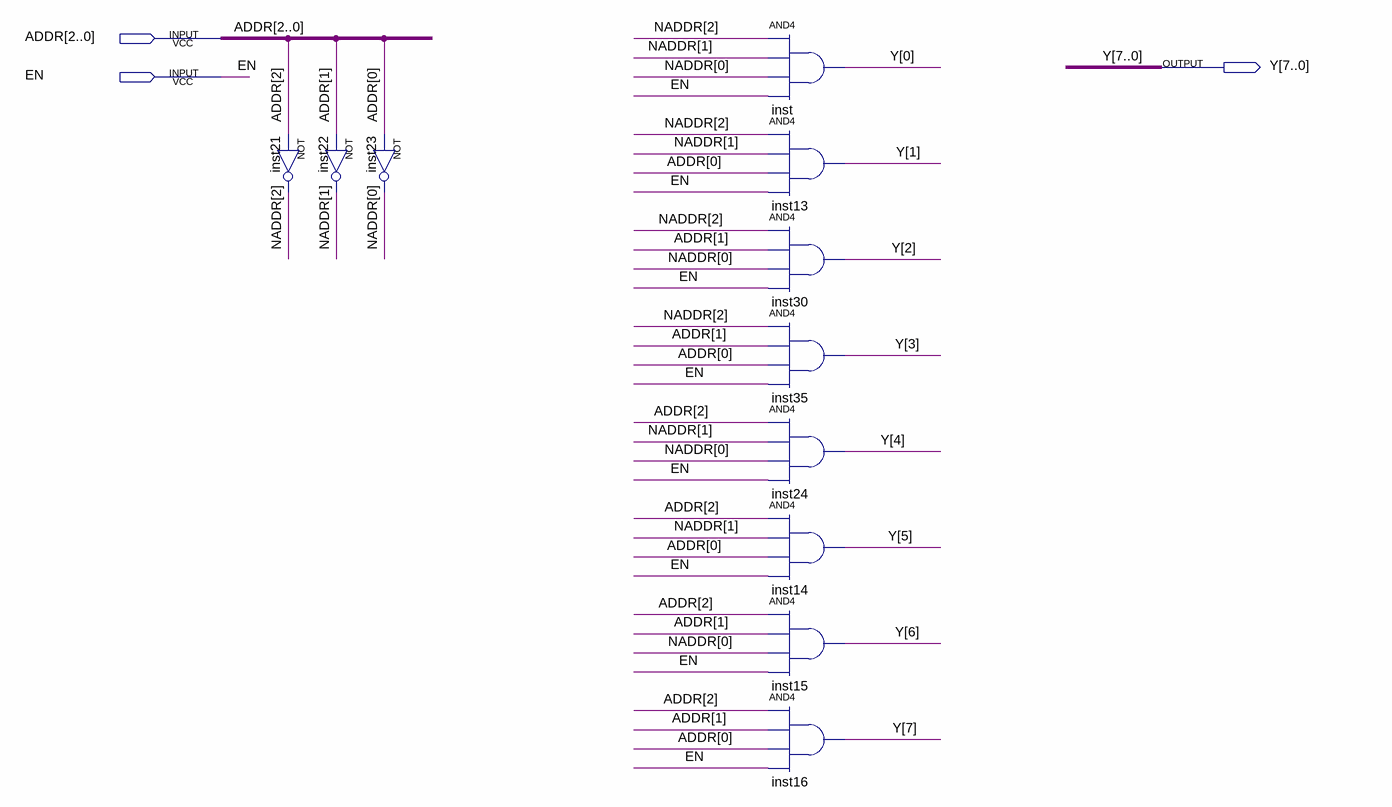
[diagram p0: schematic sheet]
// Quartus schematic DECODER_3TO8.bdf as structural Verilog: 11 symbols, 3 pins
module DECODER_3TO8 (
  input  [2:0] ADDR,
  input  EN,
  output [7:0] Y
);

  wire [2:0] NADDR;

  not inst21 (NADDR[2], ADDR[2]);
  not inst22 (NADDR[1], ADDR[1]);
  not inst23 (NADDR[0], ADDR[0]);
  and inst (Y[0], NADDR[2], NADDR[1], NADDR[0], EN);
  and inst13 (Y[1], NADDR[2], NADDR[1], ADDR[0], EN);
  and inst30 (Y[2], NADDR[2], ADDR[1], NADDR[0], EN);
  and inst35 (Y[3], NADDR[2], ADDR[1], ADDR[0], EN);
  and inst24 (Y[4], ADDR[2], NADDR[1], NADDR[0], EN);
  and inst14 (Y[5], ADDR[2], NADDR[1], ADDR[0], EN);
  and inst15 (Y[6], ADDR[2], ADDR[1], NADDR[0], EN);
  and inst16 (Y[7], ADDR[2], ADDR[1], ADDR[0], EN);
endmodule
